# EAGLE design OptronV7_PCB (EAGLE 9.3.1)
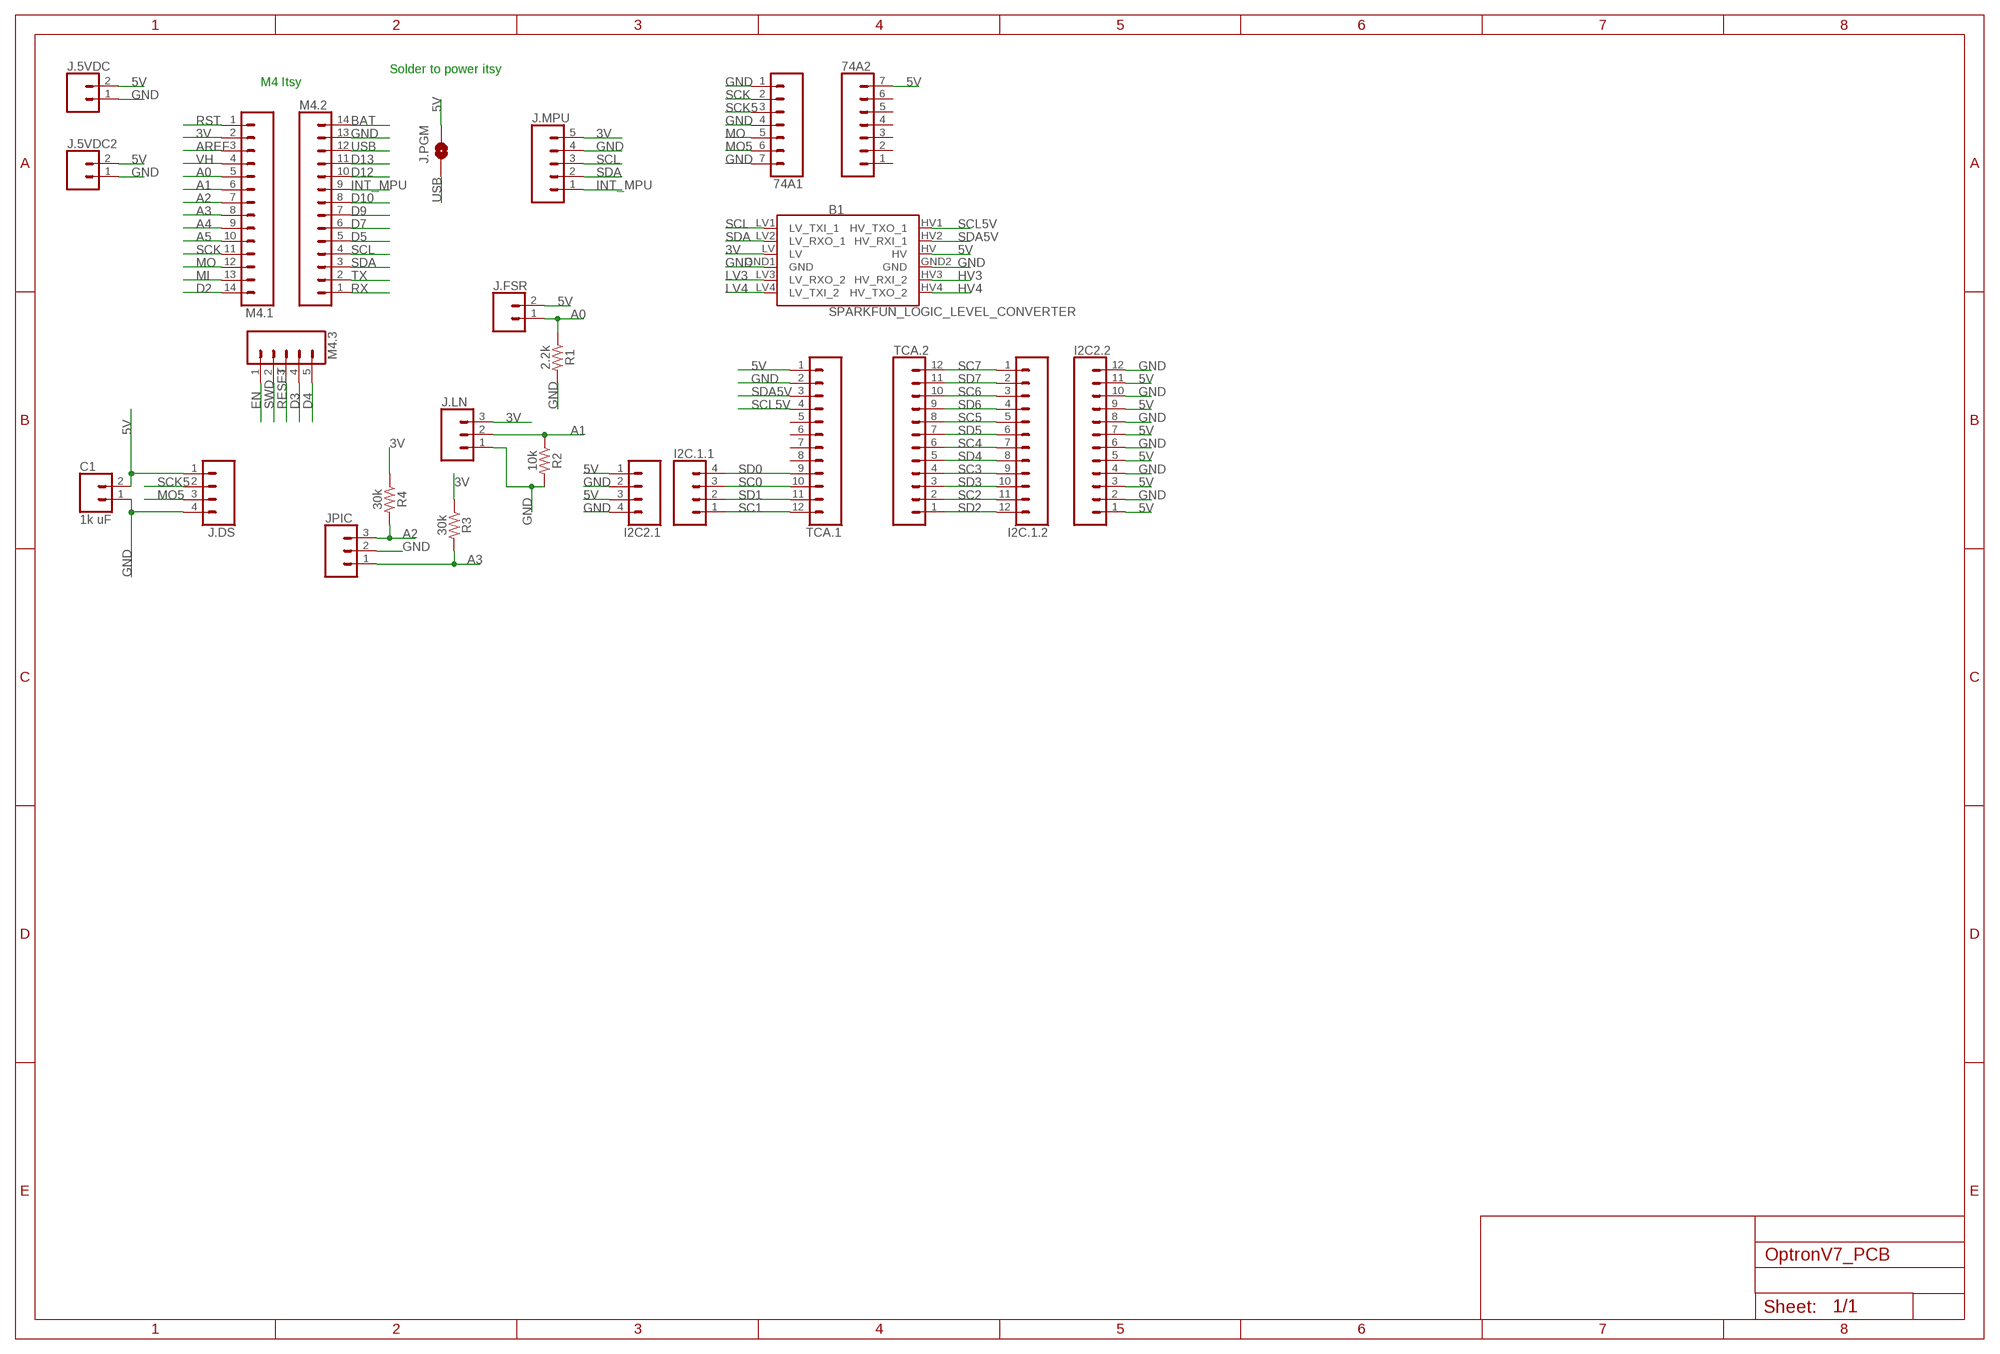
[diagram p0: schematic, sheet 1]

## Parts
74A1  CONN_07  [1X07]
74A2  CONN_07  [1X07]
B1  SPARKFUN_LOGIC_LEVEL_CONVERTER  [SPARKFUN_LOGIC_LEVEL_CONVERTER]
C1  1k uF  CONN_02  [1X02]
I2C2.1  CONN_04  [1X04]
I2C2.2  CONN_12  [1X12]
I2C.1.1  CONN_04  [1X04]
I2C.1.2  CONN_12  [1X12]
J.5VDC  CONN_02  [1X02]
J.5VDC2  CONN_02  [1X02]
J.DS  CONN_04  [1X04]
J.FSR  CONN_02  [1X02]
J.LN  CONN_03  [1X03]
J.MPU  CONN_05  [1X05]
J.PGM  JUMPER-SMT_2_NO_NO-SILK  [SMT-JUMPER_2_NO_NO-SILK]
JPIC  CONN_03  [1X03]
M4.1  CONN_14  [1X14]
M4.2  CONN_14  [1X14]
M4.3  CONN_05  [1X05]
R1  2.2k  10KOHM-HORIZ-1/4W-5%  [AXIAL-0.3]
R2  10k  10KOHM-HORIZ-1/4W-5%  [AXIAL-0.3]
R3  30k  10KOHM-HORIZ-1/4W-5%  [AXIAL-0.3]
R4  30k  10KOHM-HORIZ-1/4W-5%  [AXIAL-0.3]
TCA.1  CONN_12  [1X12]
TCA.2  CONN_12  [1X12]

## Nets
3V: B1.LV J.LN.3 J.MPU.5 M4.1.2 R3.P$1 R4.P$1
5V: 74A2.7 B1.HV C1.2 I2C2.1.1 I2C2.1.3 I2C2.2.1 I2C2.2.3 I2C2.2.5 I2C2.2.7 I2C2.2.9 I2C2.2.11 J.5VDC2.2 J.5VDC.2 J.DS.1 J.FSR.2 J.PGM.2 TCA.1.1
A0: J.FSR.1 M4.1.5 R1.P$1
A1: J.LN.2 M4.1.6 R2.P$1
A2: JPIC.3 M4.1.7 R4.P$2
A3: JPIC.1 M4.1.8 R3.P$2
A4: M4.1.9
A5: M4.1.10
AREF: M4.1.3
BAT: M4.2.14
D2: M4.1.14
D3: M4.3.4
D4: M4.3.5
D5: M4.2.5
D7: M4.2.6
D9: M4.2.7
D10: M4.2.8
D12: M4.2.10
D13: M4.2.11
EN: M4.3.1
GND: 74A1.1 74A1.4 74A1.7 B1.GND1(GND) B1.GND2(GND) C1.1 I2C2.1.2 I2C2.1.4 I2C2.2.2 I2C2.2.4 I2C2.2.6 I2C2.2.8 I2C2.2.10 I2C2.2.12 J.5VDC2.1 J.5VDC.1 J.DS.4 J.LN.1 J.MPU.4 JPIC.2 M4.2.13 R1.P$2 R2.P$2 TCA.1.2
HV3: B1.HV3(HV_RXI_2)
HV4: B1.HV4(HV_TXO_2)
INT_MPU: J.MPU.1 M4.2.9
LV3: B1.LV3(LV_RXO_2)
LV4: B1.LV4(LV_TXI_2)
MI: M4.1.13
MO: 74A1.5 M4.1.12
MO5: 74A1.6 J.DS.3
RESET: M4.3.3
RST: M4.1.1
RX: M4.2.1
SC0: I2C.1.1.3 TCA.1.10
SC1: I2C.1.1.1 TCA.1.12
SC2: I2C.1.2.11 TCA.2.2
SC3: I2C.1.2.9 TCA.2.4
SC4: I2C.1.2.7 TCA.2.6
SC5: I2C.1.2.5 TCA.2.8
SC6: I2C.1.2.3 TCA.2.10
SC7: I2C.1.2.1 TCA.2.12
SCK: 74A1.2 M4.1.11
SCK5: 74A1.3 J.DS.2
SCL: B1.LV1(LV_TXI_1) J.MPU.3 M4.2.4
SCL5V: B1.HV1(HV_TXO_1) TCA.1.4
SD0: I2C.1.1.4 TCA.1.9
SD1: I2C.1.1.2 TCA.1.11
SD2: I2C.1.2.12 TCA.2.1
SD3: I2C.1.2.10 TCA.2.3
SD4: I2C.1.2.8 TCA.2.5
SD5: I2C.1.2.6 TCA.2.7
SD6: I2C.1.2.4 TCA.2.9
SD7: I2C.1.2.2 TCA.2.11
SDA: B1.LV2(LV_RXO_1) J.MPU.2 M4.2.3
SDA5V: B1.HV2(HV_RXI_1) TCA.1.3
SWD: M4.3.2
TX: M4.2.2
USB: J.PGM.1 M4.2.12
VH: M4.1.4
Unconnected: 74A2.1 74A2.2 74A2.3 74A2.4 74A2.5 74A2.6 TCA.1.5 TCA.1.6 TCA.1.7 TCA.1.8

## Notes on the sheet
- Solder to power itsy
- M4 Itsy

## Library data of the parts
74A1 74A2 = SparkFun-Connectors:CONN_07: Multi connection point. Often used as Generic Header-pin footprint for 0.1 inch spaced/style header connections On any of the 0.1 inch spaced packages, you can populate with these: Break Away Headers - Straight <https://www.sparkfun.com/products/116> (PRT-00116) Break Away Male Headers - Right Angle <https://www.sparkfun.com/products/553> (PRT-00553) Female Headers <https://www.sparkfun.com/products/115> (PRT-00115) Break Away Headers - Machine Pin <https://www.sparkfun.com/products/117> (PRT-00117) Break Away Female Headers - Swiss Machine Pin <https://www.sparkfun.com/products/743> (PRT-00743) For SCREWTERMINALS and SPRING TERMINALS visit here: Screw Terimnals on SparkFun.com <https://www.sparkfun.com/search/results?term=Screw+Terminals> (5mm/3.5mm/2.54mm spacing) This device is also useful as a general connection point to wire up your design to another part of your project. Our various solder wires solder well into these plated through hole pads. Hook-Up Wire - Assortment (Stranded, 22 AWG) <https://www.sparkfun.com/products/11375> (PRT-11375) Hook-Up Wire - Assortment (Solid Core, 22 AWG) <https://www.sparkfun.com/products/11367> (PRT-11367) View the entire wire category on our website here <https://www.sparkfun.com/categories/141> Special notes: Molex polarized connector foot print use with SKU : PRT-08231 with associated crimp pins and housings. 1MM SMD Version SKU: PRT-10208 NOTES ON THE VARIANTS LOCK and LOCK_LONGPADS... This footprint was designed to help hold the alignment of a through-hole component (i.e. 6-pin header) while soldering it into place. You may notice that each hole has been shifted either up or down by 0.005 of an inch from it's more standard position (which is a perfectly straight line). This slight alteration caused the pins (the squares in the middle) to touch the edges of the holes. Because they are alternating, it causes a "brace" to hold the component in place. 0.005 has proven to be the perfect amount of "off-center" position when using our standard breakaway headers. Although looks a little odd when you look at the bare footprint, once you have a header in there, the alteration is very hard to notice. Also,if you push a header all the way into place, it is covered up entirely on the bottom side.
B1 = SparkFun-Boards:SPARKFUN_LOGIC_LEVEL_CONVERTER: SparkFun Logic Level Converter -Bi-Directional This is the mechnical outline for the 3.3V - 5V bi directional logic level converter. *Note, the "LOCK" Package has the header pins staggered by an offset of 5 mils (off center line), so that when you slide a row of standard 0.1" headers into the PTH pads, it will hold position vertically. See the follwing turorial for more information on this type of special footprints: Sneaky Footprints <https://www.sparkfun.com/tutorials/114> SparkFun Products: SparkFun Logic Level Converter - Bi-Directional <https://www.sparkfun.com/products/12009>
C1 J.5VDC J.5VDC2 J.FSR = SparkFun-Connectors:CONN_02: Multi connection point. Often used as Generic Header-pin footprint for 0.1 inch spaced/style header connections On any of the 0.1 inch spaced packages, you can populate with these: Break Away Headers - Straight <https://www.sparkfun.com/products/116> (PRT-00116) Break Away Male Headers - Right Angle <https://www.sparkfun.com/products/553> (PRT-00553) Female Headers <https://www.sparkfun.com/products/115> (PRT-00115) Break Away Headers - Machine Pin <https://www.sparkfun.com/products/117> (PRT-00117) Break Away Female Headers - Swiss Machine Pin <https://www.sparkfun.com/products/743> (PRT-00743) For SCREWTERMINALS and SPRING TERMINALS visit here: Screw Terimnals on SparkFun.com <https://www.sparkfun.com/search/results?term=Screw+Terminals> (5mm/3.5mm/2.54mm spacing) This device is also useful as a general connection point to wire up your design to another part of your project. Our various solder wires solder well into these plated through hole pads. Hook-Up Wire - Assortment (Stranded, 22 AWG) <https://www.sparkfun.com/products/11375> (PRT-11375) Hook-Up Wire - Assortment (Solid Core, 22 AWG) <https://www.sparkfun.com/products/11367> (PRT-11367) View the entire wire category on our website here <https://www.sparkfun.com/categories/141> Special notes: Molex polarized connector foot print use with: PRT-08233 with associated crimp pins and housings. 2.54_SCREWTERM for use with PRT-10571. 3.5mm Screw Terminal footprints for PRT-08084 5mm Screw Terminal footprints for use with PRT-08432
I2C2.1 I2C.1.1 J.DS = SparkFun-Connectors:CONN_04: Multi connection point. Often used as Generic Header-pin footprint for 0.1 inch spaced/style header connections On any of the 0.1 inch spaced packages, you can populate with these: Break Away Headers - Straight <https://www.sparkfun.com/products/116> (PRT-00116) Break Away Male Headers - Right Angle <https://www.sparkfun.com/products/553> (PRT-00553) Female Headers <https://www.sparkfun.com/products/115> (PRT-00115) Break Away Headers - Machine Pin <https://www.sparkfun.com/products/117> (PRT-00117) Break Away Female Headers - Swiss Machine Pin <https://www.sparkfun.com/products/743> (PRT-00743) For SCREWTERMINALS and SPRING TERMINALS visit here: Screw Terimnals on SparkFun.com <https://www.sparkfun.com/search/results?term=Screw+Terminals> (5mm/3.5mm/2.54mm spacing) This device is also useful as a general connection point to wire up your design to another part of your project. Our various solder wires solder well into these plated through hole pads. Hook-Up Wire - Assortment (Stranded, 22 AWG) <https://www.sparkfun.com/products/11375> (PRT-11375) Hook-Up Wire - Assortment (Solid Core, 22 AWG) <https://www.sparkfun.com/products/11367> (PRT-11367) View the entire wire category on our website here <https://www.sparkfun.com/categories/141> Special notes: Molex polarized connector foot print use with SKU : PRT-08231 with associated crimp pins and housings. 1MM SMD Version SKU: PRT-10208; PROD_ID: CONN-09696
I2C2.2 I2C.1.2 TCA.1 TCA.2 = SparkFun-Connectors:CONN_12: Multi connection point. Often used as Generic Header-pin footprint for 0.1 inch spaced/style header connections On any of the 0.1 inch spaced packages, you can populate with these: Break Away Headers - Straight <https://www.sparkfun.com/products/116> (PRT-00116) Break Away Male Headers - Right Angle <https://www.sparkfun.com/products/553> (PRT-00553) Female Headers <https://www.sparkfun.com/products/115> (PRT-00115) Break Away Headers - Machine Pin <https://www.sparkfun.com/products/117> (PRT-00117) Break Away Female Headers - Swiss Machine Pin <https://www.sparkfun.com/products/743> (PRT-00743) For SCREWTERMINALS and SPRING TERMINALS visit here: Screw Terimnals on SparkFun.com <https://www.sparkfun.com/search/results?term=Screw+Terminals> (5mm/3.5mm/2.54mm spacing) This device is also useful as a general connection point to wire up your design to another part of your project. Our various solder wires solder well into these plated through hole pads. Hook-Up Wire - Assortment (Stranded, 22 AWG) <https://www.sparkfun.com/products/11375> (PRT-11375) Hook-Up Wire - Assortment (Solid Core, 22 AWG) <https://www.sparkfun.com/products/11367> (PRT-11367) View the entire wire category on our website here <https://www.sparkfun.com/categories/141> Special notes: Molex polarized connector foot print use with SKU : PRT-08231 with associated crimp pins and housings. 1MM SMD Version SKU: PRT-10208 NOTES ON THE VARIANTS LOCK and LOCK_LONGPADS... This footprint was designed to help hold the alignment of a through-hole component (i.e. 6-pin header) while soldering it into place. You may notice that each hole has been shifted either up or down by 0.005 of an inch from it's more standard position (which is a perfectly straight line). This slight alteration caused the pins (the squares in the middle) to touch the edges of the holes. Because they are alternating, it causes a "brace" to hold the component in place. 0.005 has proven to be the perfect amount of "off-center" position when using our standard breakaway headers. Although looks a little odd when you look at the bare footprint, once you have a header in there, the alteration is very hard to notice. Also,if you push a header all the way into place, it is covered up entirely on the bottom side.
J.LN JPIC = SparkFun-Connectors:CONN_03: Multi connection point. Often used as Generic Header-pin footprint for 0.1 inch spaced/style header connections On any of the 0.1 inch spaced packages, you can populate with these: Break Away Headers - Straight <https://www.sparkfun.com/products/116> (PRT-00116) Break Away Male Headers - Right Angle <https://www.sparkfun.com/products/553> (PRT-00553) Female Headers <https://www.sparkfun.com/products/115> (PRT-00115) Break Away Headers - Machine Pin <https://www.sparkfun.com/products/117> (PRT-00117) Break Away Female Headers - Swiss Machine Pin <https://www.sparkfun.com/products/743> (PRT-00743) Stackable Header - 3 Pin (Female, 0.1") <https://www.sparkfun.com/products/13875> (PRT-13875) For SCREWTERMINALS and SPRING TERMINALS visit here: Screw Terimnals on SparkFun.com <https://www.sparkfun.com/search/results?term=Screw+Terminals> (5mm/3.5mm/2.54mm spacing) This device is also useful as a general connection point to wire up your design to another part of your project. Our various solder wires solder well into these plated through hole pads. Hook-Up Wire - Assortment (Stranded, 22 AWG) <https://www.sparkfun.com/products/11375> (PRT-11375) Hook-Up Wire - Assortment (Solid Core, 22 AWG) <https://www.sparkfun.com/products/11367> (PRT-11367) View the entire wire category on our website here <https://www.sparkfun.com/categories/141> Special notes: Molex polarized connector foot print use with SKU : PRT-08232 with associated crimp pins and housings.
J.MPU M4.3 = SparkFun-Connectors:CONN_05: Multi connection point. Often used as Generic Header-pin footprint for 0.1 inch spaced/style header connections On any of the 0.1 inch spaced packages, you can populate with these: Break Away Headers - Straight <https://www.sparkfun.com/products/116> (PRT-00116) Break Away Male Headers - Right Angle <https://www.sparkfun.com/products/553> (PRT-00553) Female Headers <https://www.sparkfun.com/products/115> (PRT-00115) Break Away Headers - Machine Pin <https://www.sparkfun.com/products/117> (PRT-00117) Break Away Female Headers - Swiss Machine Pin <https://www.sparkfun.com/products/743> (PRT-00743) For SCREWTERMINALS and SPRING TERMINALS visit here: Screw Terimnals on SparkFun.com <https://www.sparkfun.com/search/results?term=Screw+Terminals> (5mm/3.5mm/2.54mm spacing) This device is also useful as a general connection point to wire up your design to another part of your project. Our various solder wires solder well into these plated through hole pads. Hook-Up Wire - Assortment (Stranded, 22 AWG) <https://www.sparkfun.com/products/11375> (PRT-11375) Hook-Up Wire - Assortment (Solid Core, 22 AWG) <https://www.sparkfun.com/products/11367> (PRT-11367) View the entire wire category on our website here <https://www.sparkfun.com/categories/141> Special notes: Molex polarized connector foot print use with SKU : PRT-08231 with associated crimp pins and housings. 1MM SMD Version SKU: PRT-10208
J.PGM = SparkFun-Jumpers:JUMPER-SMT_2_NO: Normally open jumper This jumper has two pads in close proximity to each other. Apply solder to close the connection. Round pads are easier to solder for beginners, but are a lot larger. SparkFun Product that uses the round pads: SparkFun EL Sequencer <https://www.sparkfun.com/products/12781>
M4.1 M4.2 = SparkFun-Connectors:CONN_14: Multi connection point. Often used as Generic Header-pin footprint for 0.1 inch spaced/style header connections On any of the 0.1 inch spaced packages, you can populate with these: Break Away Headers - Straight <https://www.sparkfun.com/products/116> (PRT-00116) Break Away Male Headers - Right Angle <https://www.sparkfun.com/products/553> (PRT-00553) Female Headers <https://www.sparkfun.com/products/115> (PRT-00115) Break Away Headers - Machine Pin <https://www.sparkfun.com/products/117> (PRT-00117) Break Away Female Headers - Swiss Machine Pin <https://www.sparkfun.com/products/743> (PRT-00743) For SCREWTERMINALS and SPRING TERMINALS visit here: Screw Terimnals on SparkFun.com <https://www.sparkfun.com/search/results?term=Screw+Terminals> (5mm/3.5mm/2.54mm spacing) This device is also useful as a general connection point to wire up your design to another part of your project. Our various solder wires solder well into these plated through hole pads. Hook-Up Wire - Assortment (Stranded, 22 AWG) <https://www.sparkfun.com/products/11375> (PRT-11375) Hook-Up Wire - Assortment (Solid Core, 22 AWG) <https://www.sparkfun.com/products/11367> (PRT-11367) View the entire wire category on our website here <https://www.sparkfun.com/categories/141> Special notes: Molex polarized connector foot print use with SKU : PRT-08231 with associated crimp pins and housings. 1MM SMD Version SKU: PRT-10208 NOTES ON THE VARIANTS LOCK and LOCK_LONGPADS... This footprint was designed to help hold the alignment of a through-hole component (i.e. 6-pin header) while soldering it into place. You may notice that each hole has been shifted either up or down by 0.005 of an inch from it's more standard position (which is a perfectly straight line). This slight alteration caused the pins (the squares in the middle) to touch the edges of the holes. Because they are alternating, it causes a "brace" to hold the component in place. 0.005 has proven to be the perfect amount of "off-center" position when using our standard breakaway headers. Although looks a little odd when you look at the bare footprint, once you have a header in there, the alteration is very hard to notice. Also,if you push a header all the way into place, it is covered up entirely on the bottom side.
R1 R3 R4 = SparkFun-Resistors:10KOHM: 10kΩ resistor A resistor is a passive two-terminal electrical component that implements electrical resistance as a circuit element. Resistors act to reduce current flow, and, at the same time, act to lower voltage levels within circuits. - Wikipedia; PROD_ID: RES-09435; VALUE: 10k
R2 = SparkFun-Resistors:10KOHM: 10kΩ resistor A resistor is a passive two-terminal electrical component that implements electrical resistance as a circuit element. Resistors act to reduce current flow, and, at the same time, act to lower voltage levels within circuits. - Wikipedia; PROD_ID: RES-09435

## Board
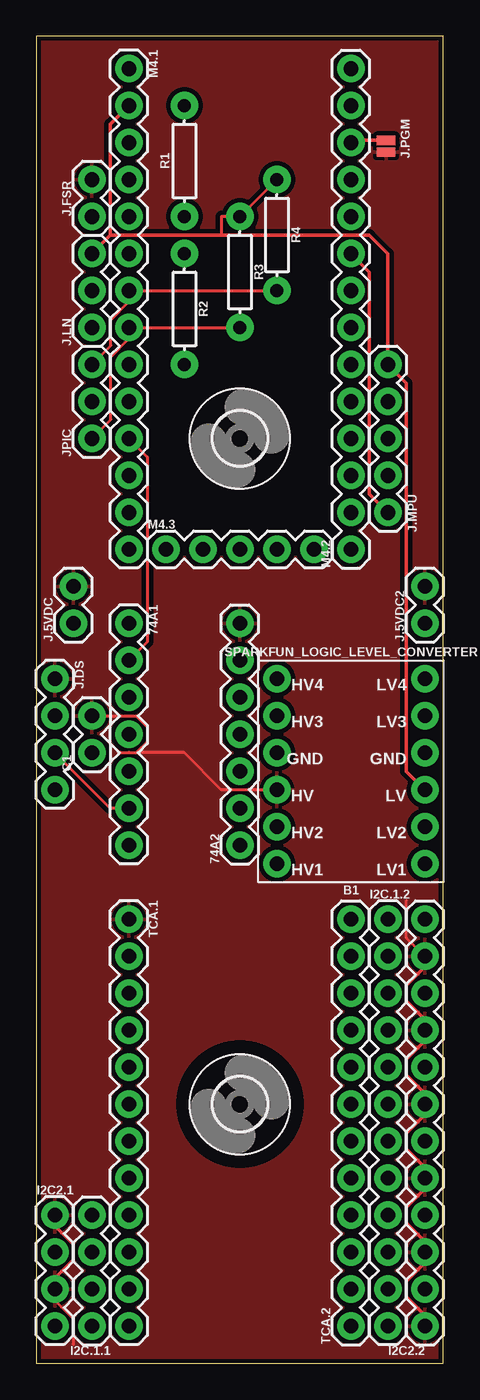
[diagram p1: board, top side]
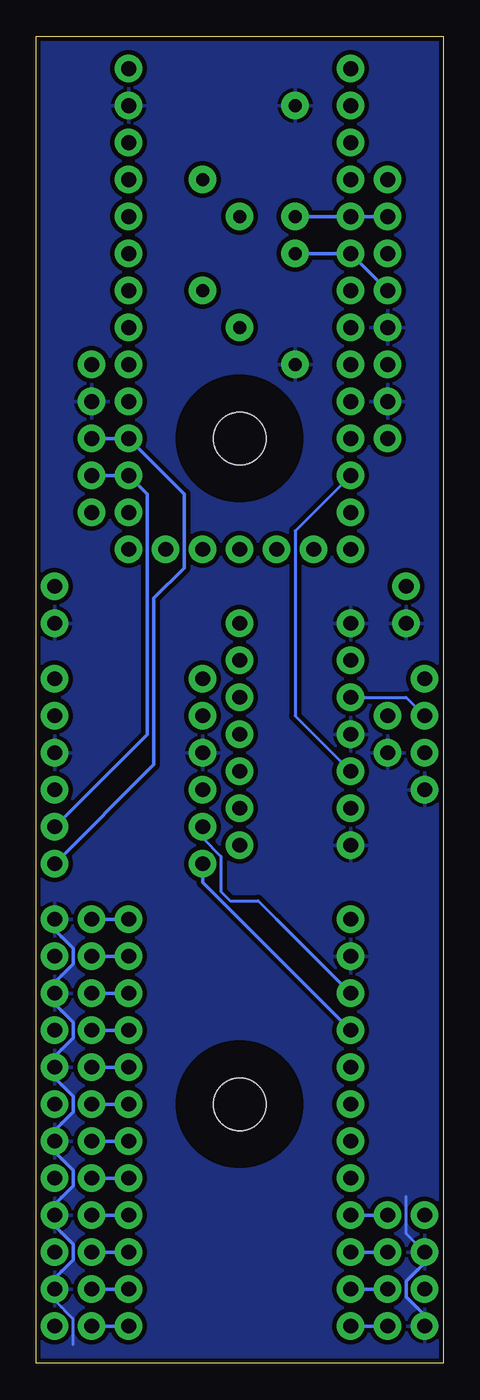
[diagram p2: board, bottom side, seen from below]

Size 27.92 x 91.11 mm. Coordinates in mm from the lower left corner, seen from the top.
Outline: 0,0 27.92,0 27.92,91.11 0,91.11 0,0
Copper layers (1*16): Top 0.035mm / dielectric 1.5mm / Bottom 0.035mm
Design rules "SparkFun": minimum track width 8mil, minimum drill 20mil, track to track 8mil, track to pad 8mil, pad to pad 8mil, via to via 8mil, smd to smd 8mil, copper to edge 8mil, drill to drill 8mil, minimum pad ring 12mil, minimum via ring 10mil, stop-mask expansion 4mil, vias tented up to drill 20mil, thermal gap 10mil

### Footprints (pad centres in the part's own frame; a part is rotated, then mirrored left to right if it is on the bottom)
1X07 = drill 1.016 pad 1.88: 1 0,0; 2 2.54,0; 3 5.08,0; 4 7.62,0; 5 10.16,0; 6 12.7,0; 7 15.24,0
SPARKFUN_LOGIC_LEVEL_CONVERTER = drill 1.016 pad 1.88: GND1 -5.08,-1.27; GND2 5.08,-1.27; HV 5.08,1.27; HV1 5.08,6.35; HV2 5.08,3.81; HV3 5.08,-3.81; HV4 5.08,-6.35; LV -5.08,1.27; LV1 -5.08,6.35; LV2 -5.08,3.81; LV3 -5.08,-3.81; LV4 -5.08,-6.35
1X02 = drill 1.016 pad 1.88: 1 0,0; 2 2.54,0
1X04 = drill 1.016 pad 1.88: 1 0,0; 2 2.54,0; 3 5.08,0; 4 7.62,0
1X12 = drill 1.016 pad 1.88: 1 0,0; 2 2.54,0; 3 5.08,0; 4 7.62,0; 5 10.16,0; 6 12.7,0; 7 15.24,0; 8 17.78,0; 9 20.32,0; 10 22.86,0; 11 25.4,0; 12 27.94,0
1X03 = drill 1.016 pad 1.88: 1 0,0; 2 2.54,0; 3 5.08,0
1X05 = drill 1.016 pad 1.88: 1 0,0; 2 2.54,0; 3 5.08,0; 4 7.62,0; 5 10.16,0
SMT-JUMPER_2_NO_NO-SILK = smd 0.635 x 1.27: 1 -0.406,0; 2 0.406,0
1X14 = drill 1.016 pad 1.88: 1 0,0; 2 2.54,0; 3 5.08,0; 4 7.62,0; 5 10.16,0; 6 12.7,0; 7 15.24,0; 8 17.78,0; 9 20.32,0; 10 22.86,0; 11 25.4,0; 12 27.94,0; 13 30.48,0; 14 33.02,0
AXIAL-0.3 = drill 0.9 pad 1.88: P$1 -3.81,0; P$2 3.81,0
3,6 = hole 3.6: 0,0

### Placement (x,y rotation side)
74A1  6.35,50.8 270 top
74A2  13.97,35.56 90 top
B1  21.59,40.64 180 top
C1  3.81,41.91 90 top
I2C2.1  1.27,10.16 270 top
I2C2.2  26.67,2.54 90 top
I2C.1.1  3.81,2.54 90 top
I2C.1.2  24.13,30.48 270 top
J.5VDC  2.54,50.8 90 top
J.5VDC2  26.67,50.8 90 top
J.DS  1.27,46.99 270 top
J.FSR  3.81,78.74 90 top
J.LN  3.81,71.12 90 top
J.MPU  24.13,58.42 90 top
J.PGM  24,83.57 270 top
JPIC  3.81,63.5 90 top
M4.1  6.35,88.9 270 top
M4.2  21.59,55.88 90 top
M4.3  8.89,55.88 0 top
R1  10.16,82.55 90 top
R2  10.16,72.39 270 top
R3  13.97,74.93 270 top
R4  16.51,77.47 270 top
TCA.1  6.35,30.48 270 top
TCA.2  21.59,2.54 90 top
U$1  [3,6]  13.97,63.5 0 top
U$2  [3,6]  13.97,17.78 0 top

### Tracks (layer width: path | path; a pad name or v marks a point on that pad's centre or on a via)
3V
  Top 0.203: 12.7,77.47 12.7,78.74 R3.P$1 R4.P$1
  Top 0.254: M4.1.2 5.08,85.09 5.08,77.47 | 5.08,77.47 J.LN.3 | 5.08,77.47 12.7,77.47 22.86,77.47 24.13,76.2 J.MPU.5 25.4,67.31 25.4,40.64 B1.LV
5V
  Top 0.203: 6.87,41.94 7.6,42.66 7.6,43.7 6.87,44.43 3.84,44.43 | 5.6,41.94 6.35,41.94 6.87,41.94 | I2C2.2.11 25.4,29.21 25.4,31.75 | I2C2.1.3 1.27,4.3 2.52,3.06 2.52,1.29 2.54,1.27 | B1.HV 12.7,39.37 10.13,41.94 6.87,41.94
  Top 0.254: I2C2.1.1 1.27,9.42 2.54,8.15 2.54,7.09 1.27,5.82 I2C2.1.3 | I2C2.2.1 26.67,3.28 25.4,4.55 25.4,5.61 26.67,6.88 I2C2.2.3 26.67,8.36 25.4,9.63 25.4,10.69 26.67,11.96 I2C2.2.5 26.67,13.44 25.4,14.71 25.4,15.77 26.67,17.04 I2C2.2.7 26.67,18.52 25.4,19.79 25.4,20.85 26.67,22.12 I2C2.2.9 26.67,23.6 25.4,24.87 25.4,25.93 26.67,27.2 I2C2.2.11
  pour Top (isolate 0.305): 0,91.06 0,0 27.94,0 27.94,91.06
A0
  Bottom 0.254: R1.P$1 M4.1.5 J.FSR.1
A1
  Bottom 0.254: R2.P$1 M4.1.6 J.LN.2
A2
  Top 0.203: JPIC.3 5.11,69.88 5.11,71.64 6.35,72.88 M4.1.7 R4.P$2
A3
  Top 0.203: JPIC.1 5.11,64.8 5.11,69.1 6.35,70.34 M4.1.8 R3.P$2
GND
  Bottom 0.203: I2C2.1.2 2.54,8.89 2.54,11.43 | I2C2.2.2 26.67,4.3 25.43,3.06 25.43,1.29 25.4,1.27
  Bottom 0.254: I2C2.2.12 26.67,29.74 25.4,28.47 25.4,27.41 26.67,26.14 I2C2.2.10 26.67,24.66 25.4,23.39 25.4,22.33 26.67,21.06 I2C2.2.8 26.67,19.58 25.4,18.31 25.4,17.25 26.67,15.98 I2C2.2.6 26.67,14.5 25.4,13.23 25.4,12.17 26.67,10.9 I2C2.2.4 26.67,9.42 25.4,8.15 25.4,7.09 26.67,5.82 I2C2.2.2 | I2C2.1.2 1.27,6.88 2.54,5.61 2.54,4.55 1.27,3.28 I2C2.1.4
  pour Bottom (isolate 0.305): 0,91.06 0,0 27.94,0 27.94,91.06
INT_MPU
  Top 0.254: J.MPU.1 22.86,59.69 22.86,74.93 M4.2.9
MO
  Bottom 0.203: 74A1.5 10.16,44.45 10.16,57.15 M4.1.12
MO5
  Top 0.203: 74A1.6 5.08,38.1 J.DS.3
SC0
  Bottom 0.254: TCA.1.10 I2C.1.1.3
SC1
  Bottom 0.254: TCA.1.12 I2C.1.1.1
SC2
  Bottom 0.254: I2C.1.2.11 TCA.2.2
SC3
  Bottom 0.254: I2C.1.2.9 TCA.2.4
SC4
  Bottom 0.254: I2C.1.2.7 TCA.2.6
SC5
  Bottom 0.254: I2C.1.2.5 TCA.2.8
SC6
  Bottom 0.254: I2C.1.2.3 TCA.2.10
SC7
  Bottom 0.254: I2C.1.2.1 TCA.2.12
SCK
  Top 0.203: M4.1.11 7.62,62.23 7.62,49.53 74A1.2
SCK5
  Bottom 0.203: 74A1.3 2.54,45.72 J.DS.2
SCL
  Bottom 0.254: J.MPU.3 M4.2.4 17.78,59.69 17.78,54.61 19.86,52.53 19.86,41.1 B1.LV1
SCL5V
  Bottom 0.254: B1.HV1 16.51,33.02 TCA.1.4
SD0
  Bottom 0.254: I2C.1.1.4 TCA.1.9
SD1
  Bottom 0.254: I2C.1.1.2 TCA.1.11
SD2
  Bottom 0.254: TCA.2.1 I2C.1.2.12
SD3
  Bottom 0.254: TCA.2.3 I2C.1.2.10
SD4
  Bottom 0.254: TCA.2.5 I2C.1.2.8
SD5
  Bottom 0.254: TCA.2.7 I2C.1.2.6
SD6
  Bottom 0.254: TCA.2.9 I2C.1.2.4
SD7
  Bottom 0.254: TCA.2.11 I2C.1.2.2
SDA
  Bottom 0.254: J.MPU.2 M4.2.3 20.32,59.69 20.32,43.18 B1.LV2
SDA5V
  Bottom 0.203: B1.HV2 16.51,36.05 15.27,34.81 15.27,32.39 14.63,31.75 12.7,31.75 11.43,30.48
  Bottom 0.254: 11.43,30.48 TCA.1.3
USB
  Top 0.254: M4.2.12 21.74,83.97 J.PGM.1